# Altium project Front_Lite_Left.PrjPcb
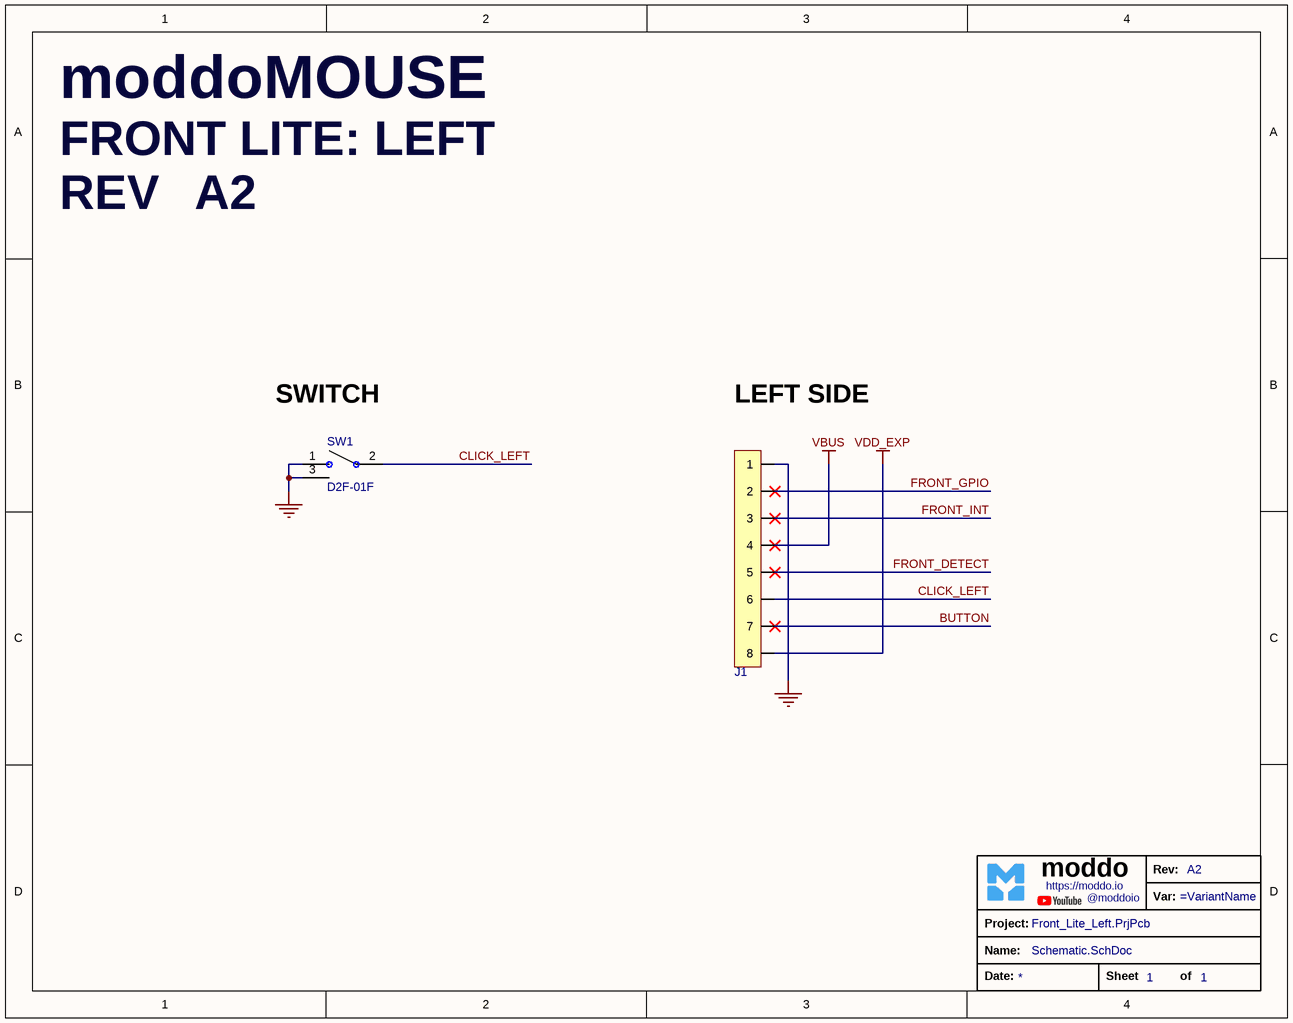
[diagram p0: Schematic.SchDoc]
Revision: A2
1 sheet, 3 parts. Net scope: global (net labels, ports and power ports of the same name join across sheets).
Board file: PCB.PcbDoc

## Sheet Schematic.SchDoc
size A; SheetNumber: 1; SheetTotal: 1

### Parts
?  TitleBlock_moddo  (value not drawn)  (graphical)
J1  1.27mm_8pins  [HEADER_MALE_1_27mm_8p_HEIGHT_1mm]  (value not drawn)
SW1  D2F-01F  [Microswitch]

### Nets
GND: J1.1 SW1.1 SW1.3
VBUS: J1.4
VDD_EXP: J1.8
BUTTON: J1.7
CLICK_LEFT: J1.6 SW1.2
FRONT_DETECT: J1.5
FRONT_GPIO: J1.2
FRONT_INT: J1.3

### Notes on the sheet
- moddoMOUSE <https://protorig.io/>
- FRONT LITE: LEFT <https://protorig.io/>
- REV
- SWITCH
- LEFT SIDE
- (in symbol TitleBlock_moddo) Rev:; moddo; https://moddo.io; Var:; @moddoio; Project:; Name:; Date:; Sheet; of

### Library data of the parts
J1 = 1.27mm_8pins: 1.27mm 1.27mm 1A 1 Gold -40℃~+105℃ 8P Phosphor Bronze Through Hole 1x8P Top 4.3mm Square Hole Through Hole,P=1.27mm Female Headers ROHS
SW1 = Microswitch: SWITCH SNAP ACTION SPDT 0.1A 30V; Manufacturer: Omron Electronics Inc-EMC Div; Manufacturer Part Number: D2F-01F